# EAGLE design spindle_pwm_controller_v1 (EAGLE 7.2.0)
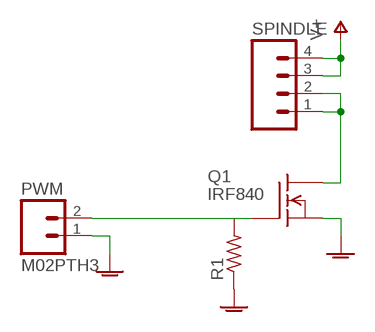
[diagram p0: schematic, sheet 1]

## Parts
PWM  M02PTH3  [1X02_LONGPADS]
Q1  IRF840  [TO220]
R1  R-US_0207/7  [0207/7]
SPINDLE  M04LONGPADS  [1X04_LONGPADS]

## Nets
GNDA: PWM.1 Q1.3(S) R1.1
N$1: Q1.2(D) SPINDLE.1 SPINDLE.2
N$2: PWM.2 Q1.1(G) R1.2
V+: SPINDLE.3 SPINDLE.4

## Library data of the parts
PWM = SparkFun-Connectors:M02: Standard 2-pin 0.1" header. Use with - straight break away headers ( PRT-00116) - right angle break away headers (PRT-00553) - swiss pins (PRT-00743) - machine pins (PRT-00117) - female headers (PRT-00115) Molex polarized connector foot print use with: PRT-08233 with associated crimp pins and housings. 2.54_SCREWTERM for use with PRT-10571. 3.5mm Screw Terminal footprints for PRT-08084 5mm Screw Terminal footprints for use with PRT-08433
Q1 = transistor-fet:IRF840: N-Channel Enhancement MOSFET (HEXFET); 500V; 8A; 0,85Ohm
R1 = rcl:R-US_: RESISTOR, American symbol
SPINDLE = SparkFun-Connectors:M04: Header 4 Standard 4-pin 0.1" header. Use with straight break away headers (SKU : PRT-00116), right angle break away headers (PRT-00553), swiss pins (PRT-00743), machine pins (PRT-00117), and female headers (PRT-00115). Molex polarized connector foot print use with SKU : PRT-08231 with associated crimp pins and housings. 1MM SMD Version SKU: PRT-10208

## Board
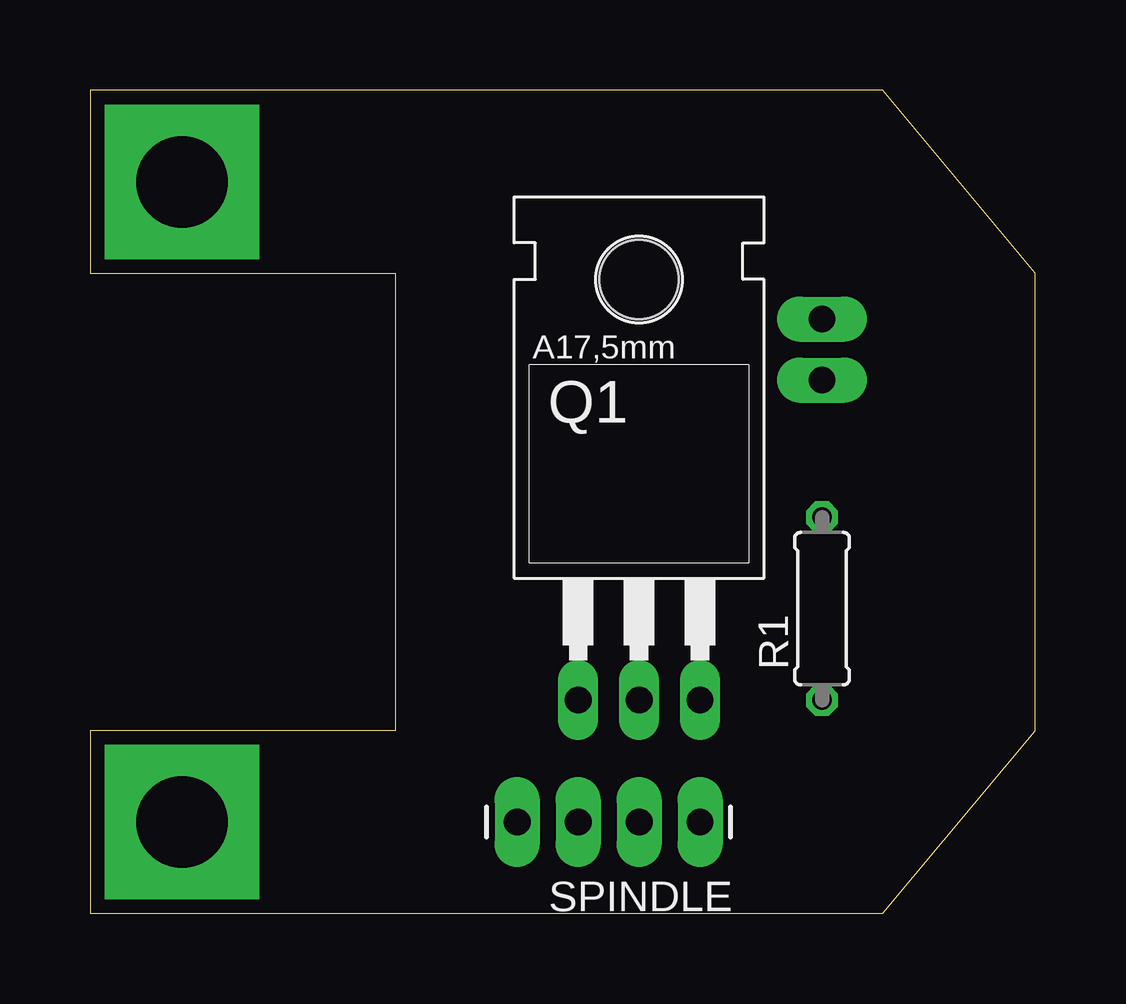
[diagram p1: board, top side]
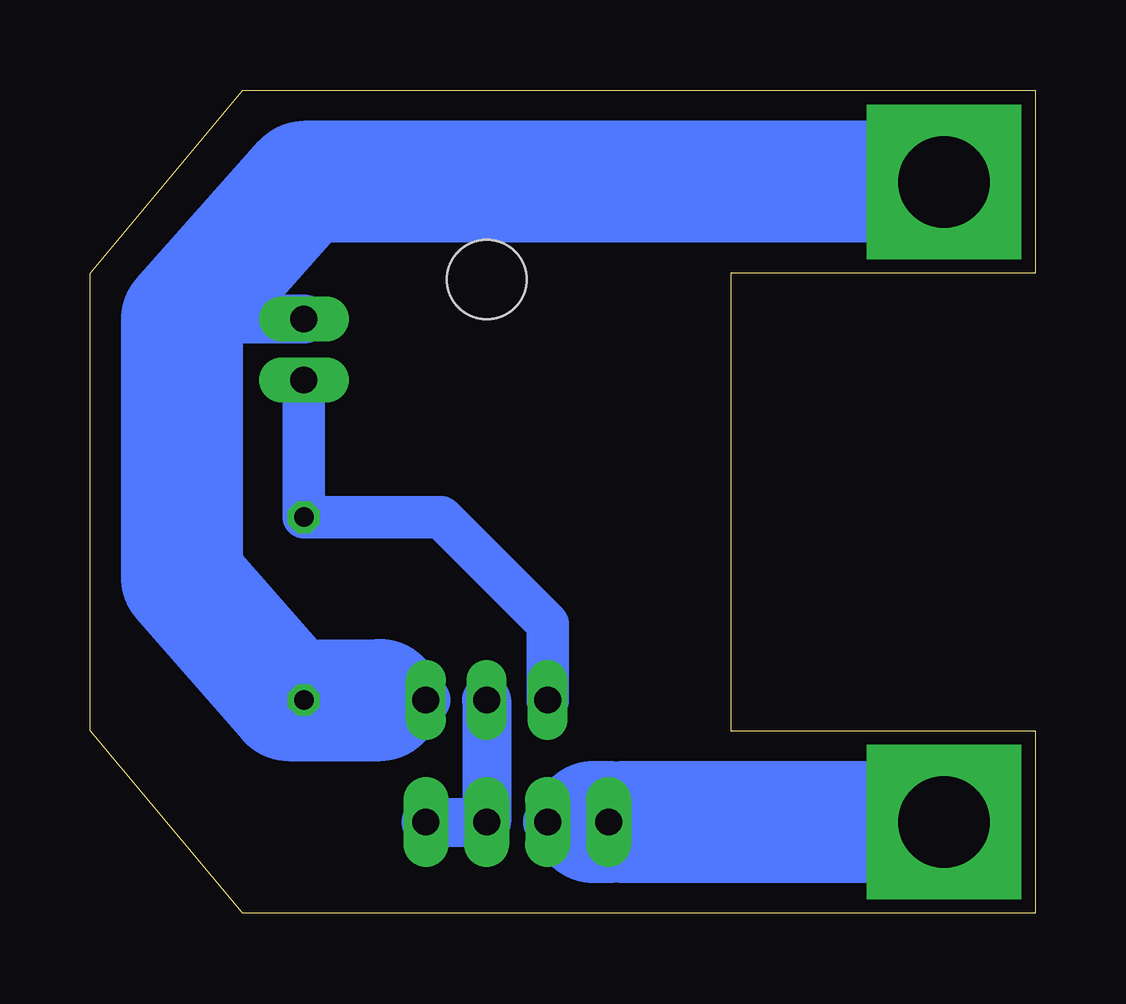
[diagram p2: board, bottom side, seen from below]

Size 39.37 x 34.29 mm. Coordinates in mm from the lower left corner, seen from the top.
Outline: 0,0 33.02,0 39.37,7.62 39.37,26.67 33.02,34.29 0,34.29 0,26.67 12.7,26.67 12.7,7.62 0,7.62 0,0
Copper layers (1*16): Top 0.035mm / dielectric 1.5mm / Bottom 0.035mm
Design rules "default *": minimum track width 10mil, minimum drill 24mil, track to track 20mil, track to pad 20mil, pad to pad 20mil, via to via 20mil, smd to smd 20mil, copper to edge 10mil, drill to drill 8mil, minimum pad ring 10mil, minimum via ring 8mil, stop-mask expansion 4mil, vias tented up to drill 0mil, thermal gap 10mil

### Footprints (pad centres in the part's own frame; a part is rotated, then mirrored left to right if it is on the bottom)
1X02_LONGPADS = drill 1.118 pad 1.88 long: 1 0,0; 2 2.54,0
TO220 = drill 1.118 long: 1 -2.54,-6.35; 2 0,-6.35; 3 2.54,-6.35 | hole 3.302: 0,11.176
0207/7 = drill 0.813 octagon: 1 -3.81,0; 2 3.81,0
1X04_LONGPADS = drill 1.118 pad 1.88 long: 1 0,0; 2 2.54,0; 3 5.08,0; 4 7.62,0

### Placement (x,y rotation side)
PWM  30.48,24.77 270 top
Q1  22.86,15.24 0 top
R1  30.48,12.7 90 top
SPINDLE  25.4,3.81 180 top

### Tracks (layer width: path | path; a pad name or v marks a point on that pad's centre or on a via)
GNDA  (via drill 3.81 pad 6.45)
  Bottom 2.032: Q1.3 27.3,8.89 | PWM.1 35.56,24.77
  Bottom 5.08: v3.81,30.48 30.48,30.48 35.56,24.77 35.56,13.97 31.11,8.89 R1.1 27.3,8.89
N$1
  Bottom 2.032: SPINDLE.1 SPINDLE.2 Q1.2
N$2
  Bottom 1.778: Q1.1 20.32,12.06 24.77,16.51 R1.2 PWM.2
V+  (via drill 3.81 pad 6.45)
  Bottom 1.778: 17.14,3.81 SPINDLE.4
  Bottom 2.032: 18.41,3.81 SPINDLE.3
  Bottom 5.08: v3.81,3.81 17.14,3.81 | SPINDLE.4 18.41,3.81